# Altium schematic sheet Circuit_driver_2.SchDoc
size A4
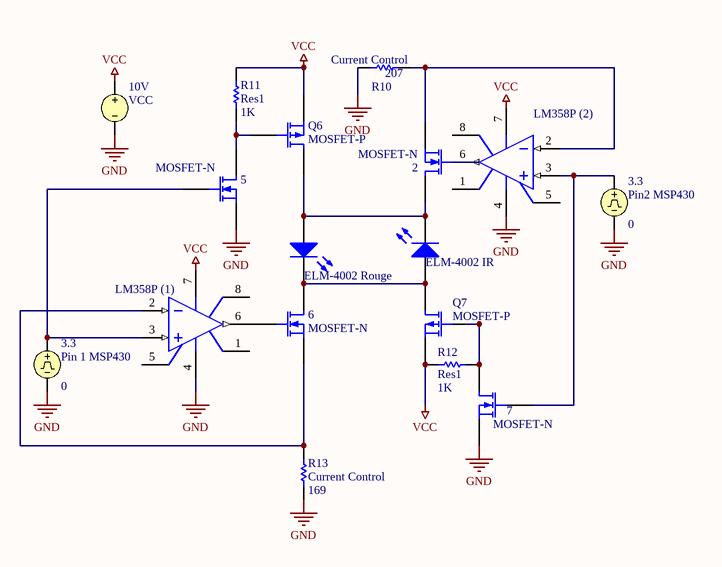
[diagram p0: Circuit_driver_2.SchDoc]

## Parts
2  MOSFET-N  [E3]
5  MOSFET-N  [E3]
6  MOSFET-N  [E3]
7  MOSFET-N  [E3]
ELM-4002_IR  IR  [LED-1]  (value not drawn)
ELM-4002_Rouge  Rouge  [LED-1]  (value not drawn)
LM358P_(1)  Op Amp  [H-08A]  (value not drawn)
LM358P_(2)  Op Amp  [H-08A]  (value not drawn)
Pin2_MSP430  Initial Value: 0  Pulsed Value: 3.3
Pin_1_MSP430  Initial Value: 0  Pulsed Value: 3.3
Q6  MOSFET-P  [E3]
Q7  MOSFET-P  [E3]
R10  Current Control  value 207  [AXIAL-0.3]
R11  Res1  value 1K  [AXIAL-0.3]
R12  Res1  value 1K  [AXIAL-0.3]
R13  Current Control  value 169  [AXIAL-0.3]
VCC  value 10V  (hidden comment: VSRC)

## Nets
GND: 5.3(S) 7.3(S) LM358P_(1).4(V-) LM358P_(2).4(V-) Pin2_MSP430.2 Pin_1_MSP430.2 R10.2 R13.1 VCC.2
VCC: LM358P_(1).7(V+) LM358P_(2).7(V+) Q6.3(S) Q7.3(S) R11.2 R12.2 VCC.1
Net2_1: 2.1(D) ELM-4002_IR.2(K) ELM-4002_Rouge.1(A) Q6.1(D)
Net2_2: 2.2(G) LM358P_(2).6(OUT)
Net2_3: 2.3(S) LM358P_(2).2(IN-) R10.1
Net5_1: 5.1(D) Q6.2(G) R11.1
Net5_2: 5.2(G) LM358P_(1).3(IN+) Pin_1_MSP430.1
Net6_1: 6.1(D) ELM-4002_IR.1(A) ELM-4002_Rouge.2(K) Q7.1(D)
Net6_2: 6.2(G) LM358P_(1).6(OUT)
Net6_3: 6.3(S) LM358P_(1).2(IN-) R13.2
Net7_1: 7.1(D) Q7.2(G) R12.1
Net7_2: 7.2(G) LM358P_(2).3(IN+) Pin2_MSP430.1

Not connected (* = marked no-connect by the designer): LM358P_(1) 1(OS_NUL) 5(OS_NUL) 8(TAB); LM358P_(2) 1(OS_NUL) 5(OS_NUL) 8(TAB)

## Library data of the parts
2 5-7 = MOSFET-N: N-Channel MOSFET; Published: 8-Jun-2000; LatestRevisionDate: 17-Jul-2002; LatestRevisionNote: Re-released for DXP Platform.; PackageVersion: 1995/1996; PackageReference: E3; Publisher: Altium Limited; PackageDescription: TO, Flat Index; 3 In-Line, Axial Leads; Body Dia. 4.6mm; Lead Dia. 0.5 mm (max)
ELM-4002_IR ELM-4002_Rouge = LED1: Typical RED GaAs LED; Published: 8-Jun-2000; LatestRevisionDate: 08-Jul-2005; LatestRevisionNote: Mech Layer 1 removed.; PackageReference: LED-1; Publisher: Altium Limited; PackageDescription: LED; 2 Leads
LM358P_(1) LM358P_(2) = Op Amp: FET Operational Amplifier; Published: 8-Jun-2000; LatestRevisionDate: 17-Jul-2002; LatestRevisionNote: Re-released for DXP Platform.; DatasheetVersion: REV. B; PackageVersion: 1990; PackageReference: H-08A; Publisher: Altium Limited; PackageDescription: Can; 8 Leads; Pin Circle Dia. 5.08 mm; Lead Dia. 0.53 mm (max); ComponentLink1Description: Manufacturer Link; ComponentLink1URL: http://www.analog.com/
Pin2_MSP430 Pin_1_MSP430 = VPULSE: Pulse Voltage Source; Note: PCB Footprint - Not required; Published: 8-Jun-2000; LatestRevisionDate: 15-Nov-2004; LatestRevisionNote: Corrected Netlist.; PackageReference: Not Applicable; Publisher: Altium Limited
Q6 Q7 = MOSFET-P: P-Channel MOSFET; Published: 8-Jun-2000; LatestRevisionDate: 17-Jul-2002; LatestRevisionNote: Re-released for DXP Platform.; PackageVersion: 1995/1996; PackageReference: E3; Publisher: Altium Limited; PackageDescription: TO, Flat Index; 3 In-Line, Axial Leads; Body Dia. 4.6mm; Lead Dia. 0.5 mm (max)
R10-R13 = Res1: Resistor; Published: 8-Jun-2000; LatestRevisionDate: 17-Jul-2002; LatestRevisionNote: Re-released for DXP Platform.; PackageReference: AXIAL-0.3; Publisher: Altium Limited; PackageDescription: Axial Device, Thru-Hole; 2 Leads; 0.3 in Pin Spacing
VCC = VSRC: Voltage Source; Note: PCB Footprint - Not required; Published: 8-Jun-2000; LatestRevisionDate: 17-Jul-2002; LatestRevisionNote: Re-released for DXP Platform.; PackageReference: Not Applicable; Publisher: Altium Limited